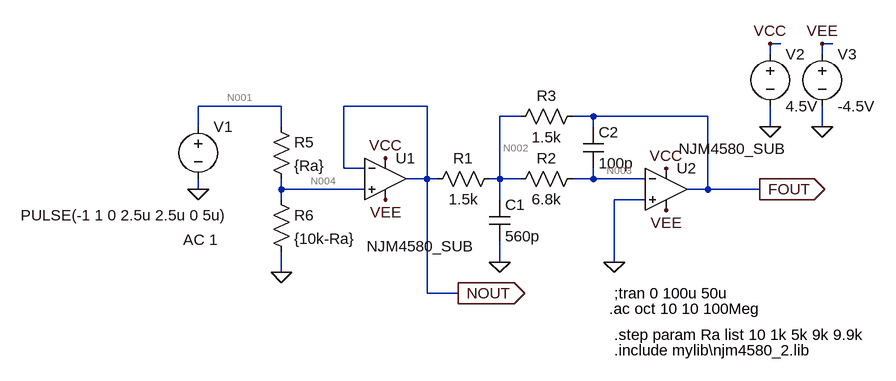
[diagram p0: schematic NJM4580 2nd MFB with POT Buffer.asc]
NJM4580 2nd MFB with POT Buffer.asc, the LTspice schematic file:
Version 4
SHEET 1 880 680
WIRE 240 -64 224 -64
WIRE 320 -64 304 -64
WIRE 224 -48 224 -64
WIRE 304 -48 304 -64
WIRE -528 32 -656 32
WIRE -304 32 -432 32
WIRE -160 48 -192 48
WIRE -48 48 -80 48
WIRE 128 48 -48 48
WIRE -656 64 -656 32
WIRE -528 64 -528 32
WIRE -48 64 -48 48
WIRE 224 64 224 32
WIRE 304 64 304 32
WIRE -432 128 -432 32
WIRE -400 128 -432 128
WIRE -304 144 -304 32
WIRE -304 144 -336 144
WIRE -288 144 -304 144
WIRE -192 144 -192 48
WIRE -192 144 -208 144
WIRE -160 144 -192 144
WIRE -48 144 -48 128
WIRE -48 144 -80 144
WIRE 32 144 -48 144
WIRE -656 160 -656 144
WIRE -528 160 -528 144
WIRE -400 160 -528 160
WIRE 128 160 128 48
WIRE 128 160 96 160
WIRE 208 160 128 160
WIRE -528 176 -528 160
WIRE -192 176 -192 144
WIRE 32 176 -16 176
WIRE -192 272 -192 240
WIRE -16 272 -16 176
WIRE -528 288 -528 256
WIRE -304 320 -304 144
WIRE -256 320 -304 320
FLAG -656 160 0
FLAG -192 272 0
FLAG -16 272 0
FLAG 224 64 0
FLAG 304 64 0
FLAG 224 -64 VCC
FLAG 304 -64 VEE
FLAG 64 128 VCC
FLAG 64 192 VEE
FLAG 208 160 FOUT
IOPIN 208 160 Out
FLAG -528 288 0
FLAG -368 112 VCC
FLAG -368 176 VEE
FLAG -256 320 NOUT
IOPIN -256 320 Out
SYMBOL res -192 128 R90
WINDOW 0 0 56 VBottom 2
WINDOW 3 32 56 VTop 2
SYMATTR InstName R1
SYMATTR Value 1.5k
SYMBOL res -64 128 R90
WINDOW 0 0 56 VBottom 2
WINDOW 3 32 56 VTop 2
SYMATTR InstName R2
SYMATTR Value 6.8k
SYMBOL res -64 32 R90
WINDOW 0 0 56 VBottom 2
WINDOW 3 32 56 VTop 2
SYMATTR InstName R3
SYMATTR Value 1.5k
SYMBOL cap -208 176 R0
SYMATTR InstName C1
SYMATTR Value 560p
SYMBOL cap -64 64 R0
SYMATTR InstName C2
SYMATTR Value 100p
SYMBOL voltage -656 48 R0
WINDOW 3 -273 152 Left 2
WINDOW 123 -23 190 Left 2
WINDOW 39 0 0 Left 2
SYMATTR Value PULSE(-1 1 0 2.5u 2.5u 0 5u)
SYMATTR Value2 AC 1
SYMATTR InstName V1
SYMBOL voltage 224 -64 R0
WINDOW 123 0 0 Left 2
WINDOW 39 0 0 Left 2
SYMATTR InstName V2
SYMATTR Value 4.5V
SYMBOL voltage 304 -64 R0
WINDOW 123 0 0 Left 2
WINDOW 39 0 0 Left 2
SYMATTR InstName V3
SYMATTR Value -4.5V
SYMBOL res -544 48 R0
SYMATTR InstName R5
SYMATTR Value {Ra}
SYMBOL res -544 160 R0
SYMATTR InstName R6
SYMATTR Value {10k-Ra}
SYMBOL Opamps\\opamp2 -368 80 R0
WINDOW 3 -29 168 Left 2
SYMATTR Value NJM4580_SUB
SYMATTR InstName U1
SYMBOL Opamps\\opamp2 64 96 R0
WINDOW 3 19 2 Left 2
SYMATTR Value NJM4580_SUB
SYMATTR InstName U2
TEXT -16 320 Left 2 !;tran 0 100u 50u
TEXT -24 344 Left 2 !.ac oct 10 10 100Meg
TEXT -16 384 Left 2 !.step param Ra list 10 1k 5k 9k 9.9k
TEXT -16 408 Left 2 !.include mylib\\njm4580_2.lib

The netlist it stands for:
* NJM4580 2nd MFB with POT Buffer.asc
R1 N002 NOUT 1.5k
R2 N003 N002 6.8k
R3 FOUT N002 1.5k
C1 N002 0 560p
C2 FOUT N003 100p
V1 N001 0 PULSE(-1 1 0 2.5u 2.5u 0 5u) AC 1
V2 VCC 0 4.5V
V3 VEE 0 -4.5V
R5 N001 N004 {Ra}
R6 N004 0 {10k-Ra}
XU1 N004 NOUT VCC VEE NOUT NJM4580_SUB  ; pins In+ In- V+ V- OUT
XU2 0 N003 VCC VEE FOUT NJM4580_SUB  ; pins In+ In- V+ V- OUT
;tran 0 100u 50u
.ac oct 10 10 100Meg
.step param Ra list 10 1k 5k 9k 9.9k
.include mylib\njm4580_2.lib
.backanno
.end

* Results of the author's LTspice run, read from the files saved beside the schematic
* Operating Point (first step), zero values left out:
*   ra = 10 
*   V(n002) = -3.743 mV
*   V(nout) = -1.002 V
*   V(n003) = -3.006 mV
*   V(fout) = 994.3 mV
*   V(n001) = -1 V
*   V(vcc) = 4.5 V
*   V(vee) = -4.5 V
*   V(n004) = -999 mV
*   I(R6) = -100 µA
*   I(R5) = -100.1 µA
*   I(R3) = 665.4 µA
*   I(R2) = 108.4 nA
*   I(R1) = 665.5 µA
*   I(V3) = 16.21 mA
*   I(V2) = -16.21 mA
*   I(V1) = 100.1 µA
*   Ix(u1:1) = -91.41 nA
*   Ix(u1:2) = -108.9 nA
*   Ix(u1:3) = 8.105 mA
*   Ix(u1:4) = -8.105 mA
*   Ix(u1:5) = 665.6 µA
*   Ix(u2:1) = -90.94 nA
*   Ix(u2:2) = -108.4 nA
*   Ix(u2:3) = 8.105 mA
*   Ix(u2:4) = -8.104 mA
*   Ix(u2:5) = -665.4 µA
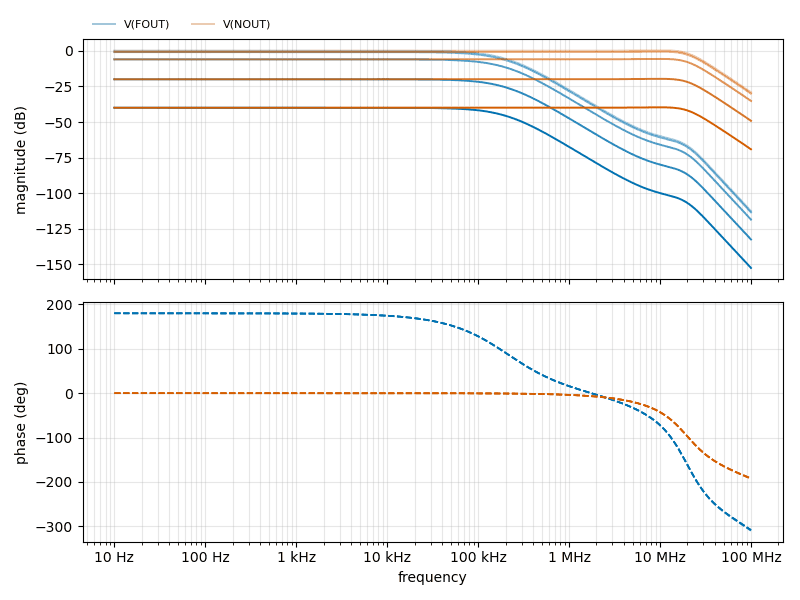
[diagram p1: AC Analysis of NJM4580 2nd MFB with POT Buffer.asc, plotted from the saved traces]
* AC Analysis, 5 runs:
*   V(FOUT) [run 1]: -0.01 dB at 10 Hz, -112.50 dB at 100 MHz, peak -0.01 dB at 10 Hz, 3 dB below the peak at 134.8 kHz
*   V(FOUT) [run 2]: -0.92 dB at 10 Hz, -113.40 dB at 100 MHz, peak -0.92 dB at 10 Hz, 3 dB below the peak at 134.8 kHz
*   V(FOUT) [run 3]: -6.02 dB at 10 Hz, -118.47 dB at 100 MHz, peak -6.02 dB at 10 Hz, 3 dB below the peak at 134.8 kHz
*   V(FOUT) [run 4]: -20.00 dB at 10 Hz, -132.41 dB at 100 MHz, peak -20.00 dB at 10 Hz, 3 dB below the peak at 134.8 kHz
*   V(FOUT) [run 5]: -40.00 dB at 10 Hz, -152.40 dB at 100 MHz, peak -40.00 dB at 10 Hz, 3 dB below the peak at 134.8 kHz
*   V(NOUT) [run 1]: -0.01 dB at 10 Hz, -29.20 dB at 100 MHz, peak 0.31 dB at 9.784 MHz, 3 dB below the peak at 21.72 MHz
*   V(NOUT) [run 2]: -0.92 dB at 10 Hz, -30.11 dB at 100 MHz, peak -0.60 dB at 9.784 MHz, 3 dB below the peak at 21.68 MHz
*   V(NOUT) [run 3]: -6.02 dB at 10 Hz, -35.21 dB at 100 MHz, peak -5.72 dB at 9.784 MHz, 3 dB below the peak at 21.59 MHz
*   V(NOUT) [run 4]: -20.00 dB at 10 Hz, -49.17 dB at 100 MHz, peak -19.70 dB at 9.784 MHz, 3 dB below the peak at 21.6 MHz
*   V(NOUT) [run 5]: -40.00 dB at 10 Hz, -69.16 dB at 100 MHz, peak -39.70 dB at 9.784 MHz, 3 dB below the peak at 21.62 MHz